# Altium schematic sheet PG04_ BALANCER.SchDoc: BMU - Cell Balancer
size B; Address1: 3511 EDISON WAY; Address2: MENLO PARK, CA, 94025; Revision: 4.1; SheetNumber: 2; SheetTotal: 9
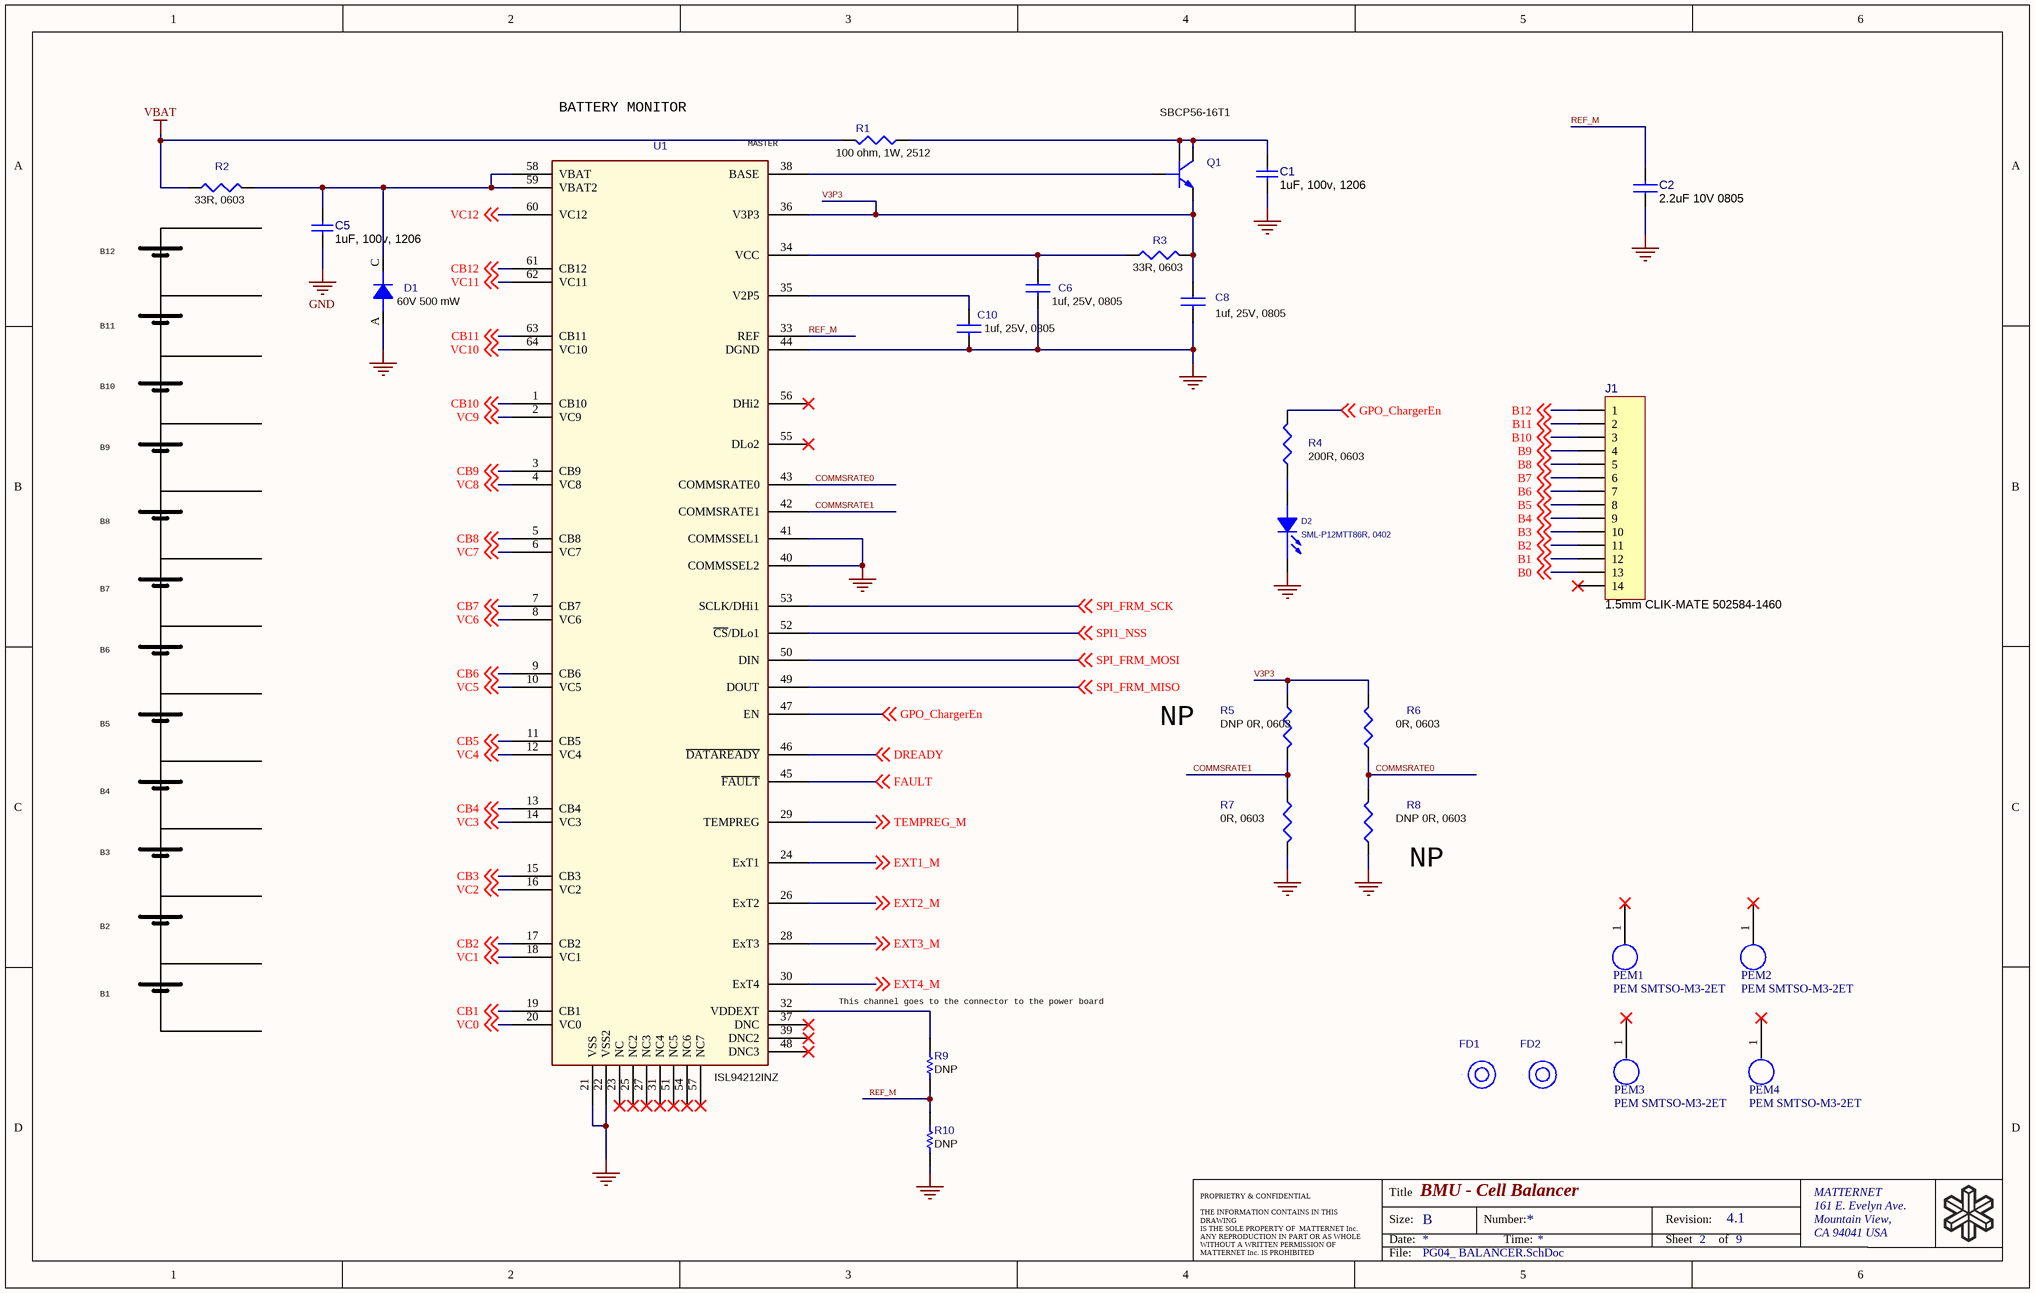
[diagram p0: PG04_ BALANCER.SchDoc]

## Parts
C1  1uF, 100v, 1206  [C1206]
C2  2.2uF 10V 0805  [C0805]
C5  1uF, 100v, 1206  [C1206]
C6  1uf, 25V, 0805  [C0805]
C8  1uf, 25V, 0805  [C0805]
C10  1uf, 25V, 0805  [C0805]
D1  60V 500 mW  [SOD-123]
D2  SML-P12MTT86R, 0402  [D0402]
FD1  FIDUCIAL_REF  [FIDUCIAL_REFDES]  (value not drawn)  (no BOM)
FD2  FIDUCIAL_REF  [FIDUCIAL_REFDES]  (value not drawn)  (no BOM)
J1  1.5mm CLIK-MATE 502584-1460  [CONN14_1p5mm_SM]
PEM1  PEM SMTSO-M3-2ET  [SMTSO-M3-2ET]
PEM2  PEM SMTSO-M3-2ET  [SMTSO-M3-2ET]
PEM3  PEM SMTSO-M3-2ET  [SMTSO-M3-2ET]
PEM4  PEM SMTSO-M3-2ET  [SMTSO-M3-2ET]
Q1  SBCP56-16T1  [SOT-223]
R1  100 ohm, 1W, 2512  [2512]
R2  33R, 0603  [R0603]
R3  33R, 0603  [R0603]
R4  200R, 0603  [R0603]
R5  DNP 0R, 0603  [R0603]  (no BOM)
R6  0R, 0603  [R0603]
R7  0R, 0603  [R0603]
R8  DNP 0R, 0603  [R0603]  (no BOM)
R9  DNP  [R0402]  (no BOM)
R10  DNP  [R0402]  (no BOM)
U1  ISL94212INZ  [TQFP-64]

## Nets
GND: C1.2 C2.1 C5.1 C6.2 C8.2 C10.2 D1.A(ANODE) D2.C(CATHODE) R7.2 R8.2 R10.1 U1.21(VSS) U1.22(VSS2) U1.40(COMMSSEL2) U1.41(COMMSSEL1) U1.44(DGND)
VBAT: R1.2 R2.1
B0: J1.13 ; off-sheet B0
B1: J1.12 ; off-sheet B1
B2: J1.11 ; off-sheet B2
B3: J1.10 ; off-sheet B3
B4: J1.9 ; off-sheet B4
B5: J1.8 ; off-sheet B5
B6: J1.7 ; off-sheet B6
B7: J1.6 ; off-sheet B7
B8: J1.5 ; off-sheet B8
B9: J1.4 ; off-sheet B9
B10: J1.3 ; off-sheet B10
B11: J1.2 ; off-sheet B11
B12: J1.1 ; off-sheet B12
CB1: U1.19(CB1) ; off-sheet CB1
CB2: U1.17(CB2) ; off-sheet CB2
CB3: U1.15(CB3) ; off-sheet CB3
CB4: U1.13(CB4) ; off-sheet CB4
CB5: U1.11(CB5) ; off-sheet CB5
CB6: U1.9(CB6) ; off-sheet CB6
CB7: U1.7(CB7) ; off-sheet CB7
CB8: U1.5(CB8) ; off-sheet CB8
CB9: U1.3(CB9) ; off-sheet CB9
CB10: U1.1(CB10) ; off-sheet CB10
CB11: U1.63(CB11) ; off-sheet CB11
CB12: U1.61(CB12) ; off-sheet CB12
COMMSRATE0: R6.2 R8.1 U1.43(COMMSRATE0)
COMMSRATE1: R5.2 R7.1 U1.42(COMMSRATE1)
DREADY: U1.46(~{DATAREADY}) ; off-sheet DREADY
EXT1_M: U1.24(ExT1) ; off-sheet EXT1_M
EXT2_M: U1.26(ExT2) ; off-sheet EXT2_M
EXT3_M: U1.28(ExT3) ; off-sheet EXT3_M
EXT4_M: U1.30(ExT4) ; off-sheet EXT4_M
FAULT: U1.45(~{FAULT}) ; off-sheet FAULT
GPO_ChargerEn: R4.2 U1.47(EN) ; off-sheet GPO_ChargerEn
REF_M: C2.2 R9.1 R10.2 U1.33(REF)
SPI1_NSS: U1.52(~{CS}/DLo1) ; off-sheet SPI1_NSS
SPI_FRM_MISO: U1.49(DOUT) ; off-sheet SPI_FRM_MISO
SPI_FRM_MOSI: U1.50(DIN) ; off-sheet SPI_FRM_MOSI
SPI_FRM_SCK: U1.53(SCLK/DHi1) ; off-sheet SPI_FRM_SCK
TEMPREG_M: U1.29(TEMPREG) ; off-sheet TEMPREG_M
V3P3: C8.1 Q1.3(E) R3.2 R5.1 R6.1 U1.36(V3P3)
VC0: U1.20(VC0) ; off-sheet VC0
VC1: U1.18(VC1) ; off-sheet VC1
VC2: U1.16(VC2) ; off-sheet VC2
VC3: U1.14(VC3) ; off-sheet VC3
VC4: U1.12(VC4) ; off-sheet VC4
VC5: U1.10(VC5) ; off-sheet VC5
VC6: U1.8(VC6) ; off-sheet VC6
VC7: U1.6(VC7) ; off-sheet VC7
VC8: U1.4(VC8) ; off-sheet VC8
VC9: U1.2(VC9) ; off-sheet VC9
VC10: U1.64(VC10) ; off-sheet VC10
VC11: U1.62(VC11) ; off-sheet VC11
VC12: U1.60(VC12) ; off-sheet VC12
NetC1_1: C1.1 Q1.2(C) Q1.4(C) R1.1
NetC5_2: C5.2 D1.C(CATHODE) R2.2 U1.58(VBAT) U1.59(VBAT2)
NetC6_1: C6.1 R3.1 U1.34(VCC)
NetC10_1: C10.1 U1.35(V2P5)
NetD2_A: D2.A(ANODE) R4.1
NetQ1_1: Q1.1(B) U1.38(BASE)
NetR9_2: R9.2 U1.32(VDDEXT)

Not connected (* = marked no-connect by the designer): FD1 1; FD2 1; J1 14*; PEM1 1*; PEM2 1*; PEM3 1*; PEM4 1*; U1 23(NC)* 25(NC2)* 27(NC3)* 31(NC4)* 37(DNC)* 39(DNC2)* 48(DNC3)* 51(NC5)* 54(NC6)* 55(DLo2)* 56(DHi2)* 57(NC7)*

## Notes on the sheet
- BATTERY MONITOR
- (near U1) MASTER
- B12
- B11
- B10
- B9
- B8
- B7
- B6
- B5
- NP
- B4
- B3
- (near R8) NP
- B2
- B1
- (near R9) This channel goes to the connector to the power board
- Title
- Size:
- Date:
- B
- Number:
- Time:
- Revision:
- Sheet
- of
- MATTERNET
- 161 E. Evelyn Ave.
- Mountain View,
- CA 94041 USA
- PROPRIETRY & CONFIDENTIAL
  THE INFORMATION CONTAINS IN THIS DRAWING
  IS THE SOLE PROPERTY OF  MATTERNET Inc.
  ANY REPRODUCTION IN PART OR AS WHOLE
  WITHOUT A WRITTEN PERMISSION OF
  MATTERNET Inc. IS PROHIBITED
- File:

## Library data of the parts
C1 C5 = Cap: CAP CER 1UF 100V X7R 1210 AUTO F; Manufacturer: KEMET; Manufacturer Part Number: C1210X105K1RACAUTO; Dielectric Material: Ceramic; Tolerance: 10%; Supplier 1: Digi-Key; Supplier Part Number 1: 399-16434-1-ND; Stock 1: 335; Pricing 1: 1=2.07, 10=1.677, 100=1.2803, 500=0.9755, 1000=0.85356 (USD); Case/Package: 1210; Voltage Rating (DC): 100V; Dielectric: X7R; Capacitance: 1uF
C2 = CAP-Generic-0805: CAP CER 2.2UF 10V 10% X7R 0805; Manufacturer: KEMET; Manufacturer Part Number: C0805X225K8RACAUTO; Dielectric Material: Ceramic; Supplier 1: Digi-Key; Supplier Part Number 1: 399-11602-1-ND; Stock 1: 2328; Pricing 1: 1=0.9, 10=0.667, 100=0.4571, 500=0.36184, 1000=0.3047 (USD); Mount: Surface Mount; Case/Package: 0805; Case Code (Metric): 2012; Case Code (Imperial): 0805; Min Operating Temperature: -55°C; Max Operating Temperature: 125°C; Packaging: Tape and Reel; Capacitance: 2.2uF; Voltage Rating: 10V; Tolerance: 10%; Voltage Rating (DC): 10V; Dielectric: X7R; Features: Soft Termination; Length: 0.079inch; Width: 0.049inch; Thickness: 0.055inch; Ratings: AEC-Q200; Supplier 2: Mouser; Supplier Part Number 2: 80-C0805X225K8RAUTO; Stock 2: 4965; Pricing 2: 1=1.06, 10=0.715, 50=0.715, 100=0.446, 1000=0.369, 10000=0.228 (USD)
C6 C8 C10 = CAP-Generic-0402: CAP CER 1UF 25V X7R 0805; Manufacturer: Murata; Manufacturer Part Number: GCJ21BR71E105KA12L; Tolerance: 10%; Supplier 1: Digi-Key; Supplier Part Number 1: 490-5802-1-ND; Stock 1: 116649; Pricing 1: 1=0.48, 10=0.333, 100=0.1997, 500=0.14974, 1000=0.12645 (USD); Mount: Surface Mount; Case/Package: 0805; Case Code (Imperial): 0805; Case Code (Metric): 2012; Min Operating Temperature: -55°C; Max Operating Temperature: 125°C; Capacitance: 1uF; Voltage Rating: 25V; Voltage Rating (DC): 25V; Packaging: Tape and Reel; Package Quantity: 3000; Dielectric: X7R; Termination: SMD/SMT; Features: Soft Termination; Length: 2mm; Width: 1.25mm; Thickness: 0.057inch; Depth: 1.25mm; Ratings: AEC-Q200; Lead Free: Lead Free
D1 = DIO-GENERIC: DIODE ZENER 60V 500MW SOD123; Manufacturer: ON Semiconductor; Manufacturer Part Number: MMSZ5264BT1G; custprt: 100-0500-000184; custinv: Ansync; Option: AB; Material: Plastic; Tolerance: 5%; Impedance: 170R; Forward Voltage: 900mV; Max Reverse Leakage Current: 100nA; Zener Current: 10mA; Test Current: 2.1mA; Element Configuration: Single; ESD Protection: Yes; Supplier 1: Digi-Key; Supplier Part Number 1: MMSZ5264BT1GOSCT-ND; Stock 1: 0; Pricing 1: 1=0.25, 10=0.201, 100=0.1067, 500=0.07016, 1000=0.04771 (USD); Case/Package: SOD-123-2; Number of Pins: 2; Contact Plating: Matte,Tin; Min Operating Temperature: -55°C; Max Operating Temperature: 150°C; Packaging: Tape and Reel; Max Power Dissipation: 500mW; Zener Voltage: 60V; Voltage Rating (DC): 60V; Power Rating: 500mW; Package Quantity: 1; Voltage Tolerance: 5%; Power Dissipation: 500mW; Working Voltage: 60V; Peak Reverse Current: 100nA; Length: 2.84mm; Height: 1.25mm; Width: 1.8mm; Radiation Hardening: No; Lead Free: Lead Free; ComponentLink1URL: http://www.onsemi.com/pub/Collateral/MMSZ5221BT1-D.PDF; ComponentLink1Description: http://www.onsemi.com/pub/Collateral/MMSZ5221BT1-D.PDF; ComponentLink2URL: https://www.verical.com/server-webapp/html/getDatasheet?partID=107391; ComponentLink2Description: https://www.verical.com/server-webapp/html/getDatasheet?partID=107391; ComponentLink3URL: http://www.mouser.com/ds/2/308/MMSZ5221BT1-D-85810.pdf; ComponentLink3Description: http://www.mouser.com/ds/2/308/MMSZ5221BT1-D-85810.pdf; ComponentLink4URL: http://www.onsemi.com/pub_link/Collateral/MMSZ5221BT1-D.PDF; ComponentLink4Description: http://www.onsemi.com/pub_link/Collateral/MMSZ5221BT1-D.PDF; ComponentLink5URL: http://uk.rs-online.com/webdocs/1276/0900766b81276af2.pdf; ComponentLink5Description: http://uk.rs-online.com/webdocs/1276/0900766b81276af2.pdf; Supplier 2: Mouser; Supplier Part Number 2: 863-MMSZ5264BT1G; Stock 2: 694; Pricing 2: 1=0.23, 10=0.156, 50=0.156, 100=0.065, 1000=0.045, 10000=0.03 (USD)
D2 = LED-GENERIC: custinv: Ansync; custprt: 100-0500-000159; Option: AB
FD1 FD2 = FIDUCIAL_REF: Option: AB
J1 = Header 14: CONN RCPT 14POS 0.059 TIN SMD; Manufacturer: Molex; Current Rating: 2A; Voltage Rating: 100V; Number of Positions: 14; Connector Type: Forked,Receptacle; Gender: Female; Glow Wire Compliant: Non-compliant; ComponentLink1URL: http://www.mouser.com/ds/2/276/5025841460_PCB_RECEPTACLES-179505.pdf; ComponentLink1Description: http://www.mouser.com/ds/2/276/5025841460_PCB_RECEPTACLES-179505.pdf; ComponentLink2URL: http://www.molex.com/pdm_docs/sd/5025841460_sd.pdf; ComponentLink2Description: http://www.molex.com/pdm_docs/sd/5025841460_sd.pdf; ComponentLink3URL: http://www.molex.com/webdocs/datasheets/pdf/en-us/5025841460_PCB_RECEPTACLES.pdf; ComponentLink3Description: http://www.molex.com/webdocs/datasheets/pdf/en-us/5025841460_PCB_RECEPTACLES.pdf; Supplier 1: Digikey; Supplier Part Number 1: WM20814CT-ND; Manufacturer Part Number: 502584-1460; Stock 1: 900; Pricing 1: 1=2.58, 10=2.341, 100=2.0064 (USD); Mount: Surface Mount; Color: Beige; Contact Plating: Tin; Contact Gender: Female; Package Quantity: 900; Number of Rows: 1; Packaging: Tape and Reel; Fastening Type: Latch; Termination: Solder; Number of Contacts: 14; Orientation: Vertical; Number of Circuits: 14; Pitch: 1.5mm; Radiation Hardening: No; REACH SVHC: No SVHC; Supplier 2: Mouser; Supplier Part Number 2: 538-502584-1460; Stock 2: 5330; Pricing 2: 1=1.96, 10=1.75, 50=1.75, 100=1.52, 1000=1.09, 10000=0.96 (USD); ComponentLink4URL: http://www.mouser.com/ds/2/276/5025841460_PCB_RECEPTACLES-179505.pdf?src-supplier=Mouser; ComponentLink4Description: http://www.mouser.com/ds/2/276/5025841460_PCB_RECEPTACLES-179505.pdf?src-supplier=Mouser; ComponentLink5URL: http://www.molex.com/pdm_docs/sd/5025841460_sd.pdf?src-supplier=Digi-Key; ComponentLink5Description: http://www.molex.com/pdm_docs/sd/5025841460_sd.pdf?src-supplier=Digi-Key; ComponentLink6URL: http://www.molex.com/webdocs/datasheets/pdf/en-us/5025841460_PCB_RECEPTACLES.pdf?src-supplier=Avnet; ComponentLink6Description: http://www.molex.com/webdocs/datasheets/pdf/en-us/5025841460_PCB_RECEPTACLES.pdf?src-supplier=Avnet
PEM1-PEM4 = PEM SMTSO-M3-2ET: PEM Nut, M3 thread
Q1 = Trans-Generic_2: TRANS NPN 80V 1.0A SOT-223; Manufacturer: ON Semiconductor; Manufacturer Part Number: SBCP56-16T1G; Max Power Dissipation: 1.5W; Frequency: 130MHz; hFE Min: 25; Max Collector Current: 1A; Collector Emitter Saturation Voltage: 500mV; Collector Base Voltage (VCBO): 100V; Number of Elements: 1; Emitter Base Voltage (VEBO): 5V; Element Configuration: Single; Supplier 1: Digi-Key; Supplier Part Number 1: SBCP56-16T1GOSCT-ND; Stock 1: 10870; Pricing 1: 1=0.59, 10=0.505, 100=0.3767, 500=0.29598 (USD); Case/Package: SOT-223-4; Number of Pins: 4; Min Operating Temperature: -65°C; Max Operating Temperature: 150°C; Package Quantity: 1000; Packaging: Tape and Reel; Collector Emitter Voltage (VCEO): 80V; Transition Frequency: 130MHz; Collector Emitter Breakdown Voltage: 80V; Polarity: NPN; Max Breakdown Voltage: 80V; Power Dissipation: 1.5W; Gain Bandwidth Product: 130MHz; Max Frequency: 130MHz; Length: 6.7mm; Height: 1.65mm; Width: 3.7mm; Radiation Hardening: No; Lead Free: Lead Free; ComponentLink1URL: http://www.onsemi.com/pub/Collateral/BCP56T1-D.PDF?src-supplier=Digi-Key; ComponentLink1Description: http://www.onsemi.com/pub/Collateral/BCP56T1-D.PDF?src-supplier=Digi-Key; ComponentLink2URL: http://www.onsemi.com/pub_link/Collateral/BCP56T1-D.PDF?src-supplier=Future+Electronics; ComponentLink2Description: http://www.onsemi.com/pub_link/Collateral/BCP56T1-D.PDF?src-supplier=Future+Electronics; ComponentLink3URL: http://www.onsemi.com/pub/Collateral/BCP56T1-D.PDF?src-supplier=Avnet+Europe; ComponentLink3Description: http://www.onsemi.com/pub/Collateral/BCP56T1-D.PDF?src-supplier=Avnet+Europe; Supplier 2: Mouser; Supplier Part Number 2: 863-SBCP56-16T1G; Stock 2: 108192; Pricing 2: 1=0.55, 10=0.45, 50=0.45, 100=0.274, 1000=0.212, 10000=0.168 (USD)
R1 = R-Generic: RES SMD 100 OHM 5% 1W 2512; Manufacturer: Panasonic; Manufacturer Part Number: ERJ-1TYJ101U; custprt: 100-0100-000214; custinv: Ansync; Option: AB; Resistance: 100R; Temperature Coefficient: 200ppm/°C; Voltage Rating: 200V; Voltage Rating (DC): 250V; Supplier 1: Mouser; Supplier Part Number 1: 667-ERJ-1TYJ101U; Stock 1: 275; Pricing 1: 1=0.39, 10=0.28, 50=0.169, 100=0.125, 1000=0.07, 10000=0.053 (USD); Mount: Surface Mount; Case/Package: 2512; Contact Plating: Tin; Case Code (Metric): 6432; Case Code (Imperial): 2512; Min Operating Temperature: -55°C; Max Operating Temperature: 155°C; Tolerance: 5%; Power Rating: 1W; Composition: Thick Film; Packaging: Tape and Reel; Package Quantity: 4000; Number of Terminations: 2; Termination: SMD/SMT; Military Standard: Not; Max Power Dissipation: 1W; Features: Automotive AEC-Q200; Length: 6.4mm; Height: 0.6mm; Width: 0.126inch; Depth: 3.2mm; Radiation Hardening: No; REACH SVHC: No SVHC; Lead Free: Lead Free; ComponentLink1URL: http://www.farnell.com/datasheets/1678796.pdf; ComponentLink1Description: http://www.farnell.com/datasheets/1678796.pdf; ComponentLink2URL: http://industrial.panasonic.com/www-data/pdf/AOA0000/AOA0000CE1.pdf; ComponentLink2Description: http://industrial.panasonic.com/www-data/pdf/AOA0000/AOA0000CE1.pdf; ComponentLink3URL: http://www.mouser.com/ds/2/315/AOA0000C84-947596.pdf; ComponentLink3Description: http://www.mouser.com/ds/2/315/AOA0000C84-947596.pdf; ComponentLink4URL: https://www.alliedelec.com/m/d/51cd0790071e1666bdb9d00c57fcf960.pdf; ComponentLink4Description: https://www.alliedelec.com/m/d/51cd0790071e1666bdb9d00c57fcf960.pdf
R2 R3 = R-Generic-0603: RES SMD 33 OHM 1% 1/10W 0603; Manufacturer: Yageo; Manufacturer Part Number: AC0603FR-0733RL; custprt: 100-0110-000153; custinv: Ansync; Option: AB; Power Rating: 100mW; Voltage Rating: 50V; Temperature Coefficient: 100ppm/°C; Supplier 1: Digi-Key; Supplier Part Number 1: YAG3599CT-ND; Stock 1: 70551; Pricing 1: 1=0.1, 10=0.032, 100=0.0129, 1000=0.00579, 2500=0.00502 (USD); Case/Package: 0603; Case Code (Imperial): 0603; Case Code (Metric): 1608; Min Operating Temperature: -55°C; Max Operating Temperature: 155°C; Packaging: Tape and Reel; Resistance: 33R; Tolerance: 1%; Composition: Thick Film; Termination: SMD/SMT; Number of Terminations: 2; Max Power Dissipation: 100mW; Features: Automotive AEC-Q200,Moisture Resistant; Length: 0.063inch; Height: 0.022inch; Width: 0.8mm
R4 = R-Generic-0603: RES SMD 200 OHM 1% 1/10W 0603; Manufacturer: Yageo; Manufacturer Part Number: AC0603FR-07200RL; custprt: 100-0110-000074; custinv: Ansync; Option: AB; Max Power Dissipation: 100mW; Temperature Coefficient: 100ppm/°C; Supplier 1: Digi-Key; Supplier Part Number 1: YAG3576CT-ND; Stock 1: 46237; Pricing 1: 1=0.1, 10=0.032, 100=0.0129, 1000=0.00579, 2500=0.00502 (USD); Case/Package: 0603; Case Code (Metric): 1608; Case Code (Imperial): 0603; Min Operating Temperature: -55°C; Max Operating Temperature: 155°C; Packaging: Tape and Reel; Resistance: 200R; Composition: Thick Film; Number of Terminations: 2; Tolerance: 1%; Features: Automotive AEC-Q200,Moisture Resistant; Length: 0.063inch; Height: 0.022inch; Width: 0.031inch
R5 R8 = R-Generic-0402: DNP; custinv: Ansync; custprt: 100-0120-000002; Option: N
R6 R7 = R-Generic-0402: RES SMD 0 OHM JUMPER 1/10W 0603; Manufacturer: Yageo; Manufacturer Part Number: RC0603FR-070RL; custinv: Ansync; custprt: 100-0120-000002; Option: AB; Resistance: 0mR; Power Rating: 100mW; Tolerance: 1%; Voltage Rating (DC): 50V; Temperature Coefficient: 200ppm/°C; Current Rating: 1A; Working Voltage: 75V; Supplier 1: Digi-Key; Supplier Part Number 1: 311-0.0HRCT-ND; Stock 1: 3289463; Pricing 1: 1=0.1, 10=0.021, 25=0.0152, 50=0.0114, 100=0.0084, 250=0.00644, 500=0.00514, 1000=0.00379 (USD); Case/Package: 0603; Number of Pins: 2; Contact Plating: Matte,Tin; Case Code (Metric): 1608; Case Code (Imperial): 0603; Min Operating Temperature: -55°C; Max Operating Temperature: 155°C; Composition: Thick Film; Packaging: Tape and Reel; Package Quantity: 5000; Voltage Rating: 50V; Number of Terminations: 2; Termination: SMD/SMT; Military Standard: Not; Max Power Dissipation: 100mW; Features: Moisture Resistant; Length: 1.6mm; Height: 0.45mm; Width: 0.031inch; Depth: 0.8mm; Radiation Hardening: No; REACH SVHC: No SVHC; Lead Free: Lead Free; ComponentLink1URL: http://www.farnell.com/datasheets/1868787.pdf; ComponentLink1Description: http://www.farnell.com/datasheets/1868787.pdf; ComponentLink2URL: http://www.farnell.com/datasheets/443971.pdf; ComponentLink2Description: http://www.farnell.com/datasheets/443971.pdf; ComponentLink3URL: http://www.yageo.com/documents/recent/PYu-RC_Group_51_RoHS_L_9.pdf; ComponentLink3Description: http://www.yageo.com/documents/recent/PYu-RC_Group_51_RoHS_L_9.pdf; ComponentLink4URL: http://documents.rs-components.com/techlib://itc_doclist_GB.htm?stockno=5048827; ComponentLink4Description: http://documents.rs-components.com/techlib://itc_doclist_GB.htm?stockno=5048827
R9 R10 = Res1: Resistor; Published: 8-Jun-2000; LatestRevisionDate: 17-Jul-2002; LatestRevisionNote: Re-released for DXP Platform.; PackageReference: AXIAL-0.3; Publisher: Altium Limited; PackageDescription: Axial Device, Thru-Hole; 2 Leads; 0.3 in Pin Spacing
U1 = BATTMAN-ISL94212INZ-700-498: Battery Management Multi-Cell Li-Ion Battery Manager; Manufacturer: Renesas; Option: AB; Max Supply Current: 5mA; Mount: Surface Mount; Case/Package: QFP; Number of Pins: 64; Min Operating Temperature: -40°C; Max Operating Temperature: 85°C; Package Quantity: 160; Packaging: Tray; Radiation Hardening: No; ComponentLink1URL: http://www.intersil.com/products/deviceinfo.asp?pn=ISL94212; ComponentLink1Description: http://www.intersil.com/products/deviceinfo.asp?pn=ISL94212; ComponentLink2URL: http://www.intersil.com/content/dam/Intersil/documents/isl9/isl94212.pdf; ComponentLink2Description: http://www.intersil.com/content/dam/Intersil/documents/isl9/isl94212.pdf; Supplier 1: Mouser; Supplier Part Number 1: 968-ISL94212INZ; Stock 1: 447; Pricing 1: 1=11.53, 10=10.42, 50=9.94, 100=8.63, 1000=6.55, 10000=6.55 (USD); Manufacturer Part Number: ISL94212INZ